# EAGLE design ppmacBoard (EAGLE 6.4)
DATABASE: /home/rw247/eagle/db/digikeydb.txt
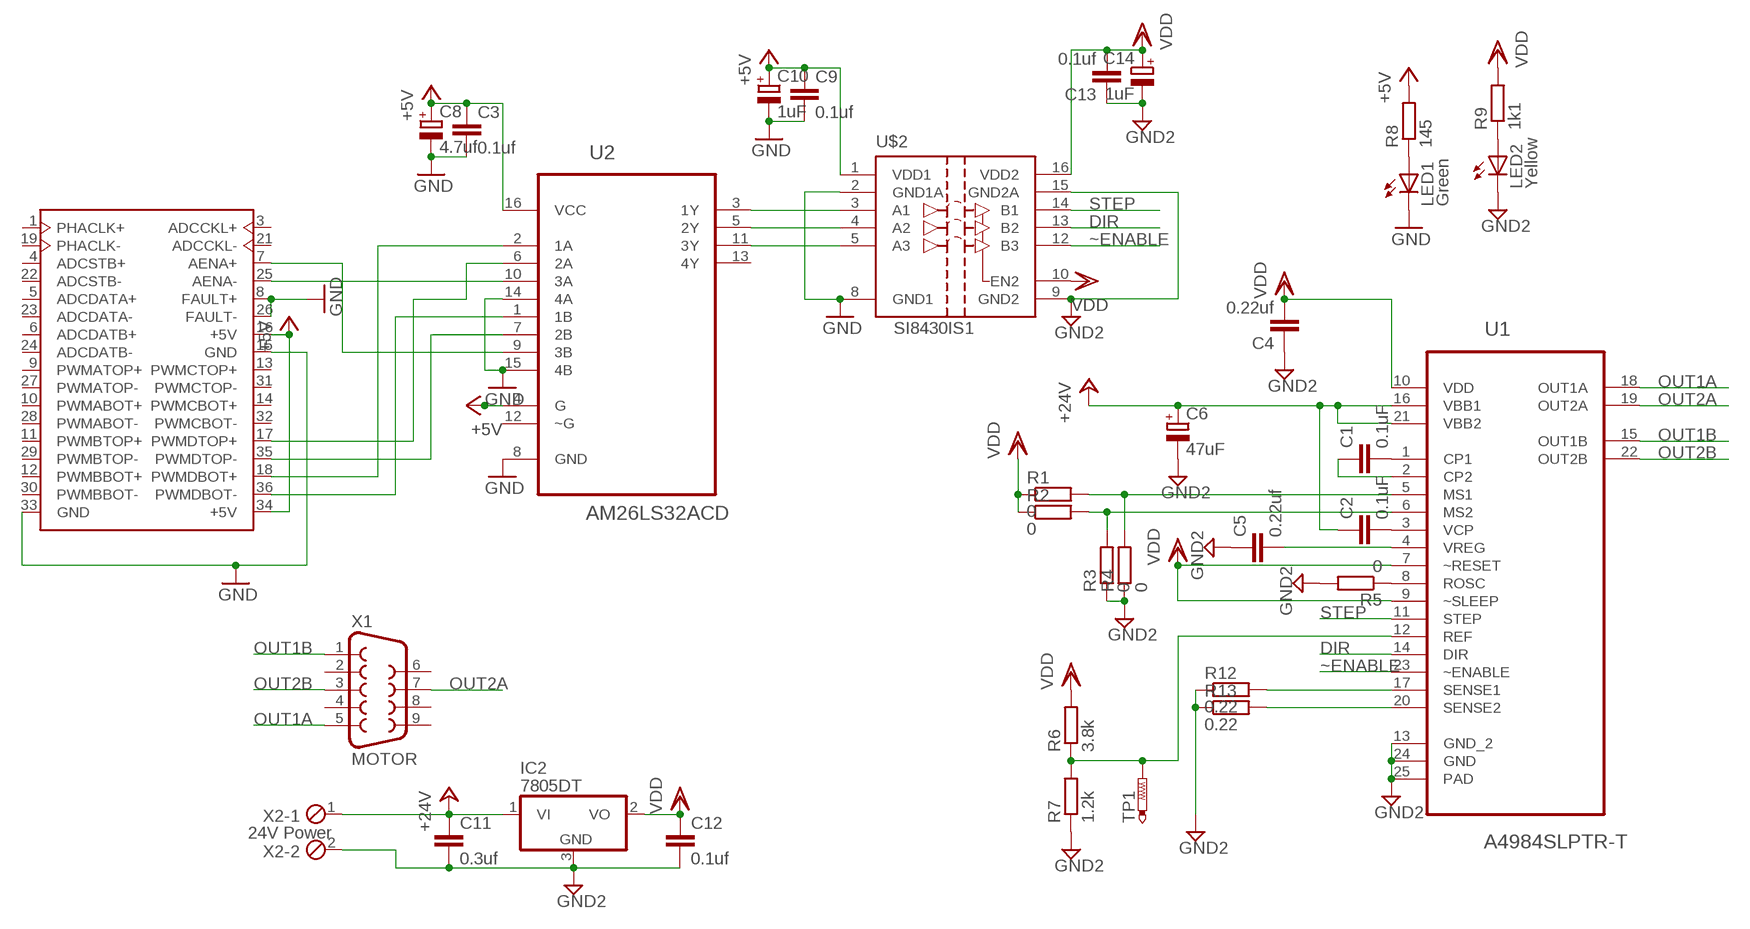
[diagram p0: schematic, sheet 1]

## Parts
C1  0.1uF  C-EUC1206  [C1206]
C2  0.1uF  C-EUC1206  [C1206]
C3  0.1uf  C-EUC1206  [C1206]
C4  0.22uf  C-EUC1206  [C1206]
C5  0.22uf  C-EUC1206  [C1206]
C6  47uF  CPOL-EUE7.5-18  [E7,5-18]
C8  4.7uf  CPOL-EUA/3216-18W  [A/3216-18W]
C9  0.1uf  C-EUC1206  [C1206]
C10  1uF  CPOL-EUA/3216-18W  [A/3216-18W]
C11  0.3uf  C-EUC1206  [C1206]
C12  0.1uf  C-EUC1206  [C1206]
C13  0.1uf  C-EUC1206  [C1206]
C14  1uF  CPOL-EUA/3216-18W  [A/3216-18W]
IC2  7805DT  [TO252]
LED1  Green  LEDSMT1206  [1206]
LED2  Yellow  LEDSMT1206  [1206]
R1  0  R-EU_R1206  [R1206]
R2  0  R-EU_R1206  [R1206]
R3  0  R-EU_R1206  [R1206]
R4  0  R-EU_R1206  [R1206]
R5  0  R-EU_R1206  [R1206]
R6  3.8k  R-EU_R1206  [R1206]
R7  1.2k  R-EU_R1206  [R1206]
R8  145  R-EU_R1206  [R1206]
R9  1k1  R-EU_R1206  [R1206]
R12  0.22  R-EU_R2010  [R2010]
R13  0.22  R-EU_R2010  [R2010]
TP1  PTR1PAD1-13  [P1-13]
U1  A4984SLPTR-T  [SOP65P640X120-24N]
U2  AM26LS32ACD  [SOIC127P600X175-16N]
U$1  DIGAMPOUT_PCB  [3M_10136-52B2PC_PCB]
U$2  SI8430IS1  [SO16]
X1  MOTOR  F09H  [F09H]
X2  24V Power  MPT2  [2POL254]

## Nets
+5V: C3.1 C8.+ C9.1 C10.+ R8.2 U2.4(G) U2.16(VCC) U$1.16(+5V) U$1.34(+5V) U$2.1(VDD1)
+24V: C2.1 C6.+ C11.1 IC2.1(VI) U1.16(VBB1) U1.21(VBB2) X2.1
DIR: U1.14(DIR) U$2.13(B2)
GND: C3.2 C8.- C9.2 C10.- LED1.C U2.8(GND) U2.14(4A) U2.15(4B) U$1.8(FAULT+) U$1.15(GND) U$1.26(FAULT-) U$1.33(GND) U$2.2(GND1A) U$2.8(GND1)
GND2: C4.1 C5.1 C6.- C11.2 C12.2 C13.1 C14.- IC2.3(GND) LED2.C R3.1 R4.1 R5.2 R7.1 R12.1 R13.1 U1.13(GND_2) U1.24(GND) U1.25(PAD) U$2.9(GND2) U$2.15(GND2A) X2.2
N$1: R2.2 R3.2 U1.6(MS2)
N$2: R1.2 R4.2 U1.5(MS1)
N$3: C1.2 U1.1(CP1)
N$4: C2.2 U1.3(VCP)
N$5: C1.1 U1.2(CP2)
N$6: LED1.A R8.1
N$7: R12.2 U1.17(SENSE1)
N$8: R6.1 R7.2 TP1.TP U1.12(REF)
N$9: C5.2 U1.4(VREG)
N$10: R5.1 U1.8(ROSC)
N$12: U2.10(3A) U$1.25(AENA-)
N$13: U2.9(3B) U$1.7(AENA+)
N$14: U2.2(1A) U$1.18(PWMDBOT+)
N$15: U2.1(1B) U$1.36(PWMDBOT-)
N$16: U2.7(2B) U$1.35(PWMDTOP-)
N$17: U2.6(2A) U$1.17(PWMDTOP+)
N$22: U2.3(1Y) U$2.3(A1)
N$23: U2.5(2Y) U$2.4(A2)
N$24: U2.11(3Y) U$2.5(A3)
N$25: LED2.A R9.1
N$30: R13.2 U1.20(SENSE2)
OUT1A: U1.18(OUT1A) X1.5
OUT1B: U1.15(OUT1B) X1.1
OUT2A: U1.19(OUT2A) X1.7
OUT2B: U1.22(OUT2B) X1.3
STEP: U1.11(STEP) U$2.14(B1)
VDD: C4.2 C12.1 C13.2 C14.+ IC2.2(VO) R1.1 R2.1 R6.2 R9.2 U1.7(~RESET) U1.9(~SLEEP) U1.10(VDD) U$2.10(EN2) U$2.16(VDD2)
~ENABLE: U1.23(~ENABLE) U$2.12(B3)
Unconnected: U2.12(~G) U2.13(4Y) U$1.1(PHACLK+) U$1.3(ADCCKL+) U$1.4(ADCSTB+) U$1.5(ADCDATA+) U$1.6(ADCDATB+) U$1.9(PWMATOP+) U$1.10(PWMABOT+) U$1.11(PWMBTOP+) U$1.12(PWMBBOT+) U$1.13(PWMCTOP+) U$1.14(PWMCBOT+) U$1.19(PHACLK-) U$1.21(ADCCKL-) U$1.22(ADCSTB-) U$1.23(ADCDATA-) U$1.24(ADCDATB-) U$1.27(PWMATOP-) U$1.28(PWMABOT-) U$1.29(PWMBTOP-) U$1.30(PWMBBOT-) U$1.31(PWMCTOP-) U$1.32(PWMCBOT-) X1.2 X1.4 X1.6 X1.8 X1.9

## Library data of the parts
C1 C2 = resistor:C-EU: CAPACITOR, European symbol; MPN: MC1206B104K250CT; OC_NEWARK: 06R4206; PARTNO: C1206C104K3RACTU
C3 C9 C12 C13 = resistor:C-EU: CAPACITOR, European symbol; OC_NEWARK: unknown; PARTNO: C1206C104K3RACTU
C4 C5 = resistor:C-EU: CAPACITOR, European symbol; OC_NEWARK: unknown; PARTNO: C1206C224K5RACTU
C6 = resistor:CPOL-EU: POLARIZED CAPACITOR, European symbol; OC_NEWARK: unknown; PARTNO: ESH476M035AE3AA
C8 = resistor:CPOL-EU: POLARIZED CAPACITOR, European symbol; OC_NEWARK: unknown; PARTNO: T491A475M025AT
C10 C14 = resistor:CPOL-EU: POLARIZED CAPACITOR, European symbol; OC_NEWARK: unknown; PARTNO: T491A105K025AT
C11 = resistor:C-EU: CAPACITOR, European symbol; OC_NEWARK: unknown; PARTNO: C3216X7R1E334K
IC2 = linear:78*: Positive VOLTAGE REGULATOR Source: http://cache.national.com/ds/LM/LM78L05.pdf http://www.fairchildsemi.com/ds/LM/LM7805.pdf; OC_NEWARK: unknown; PARTNO: BA17805FP-E2
LED1 = led:LED: LED OSRAM: - CHIPLED LG R971, LG N971, LY N971, LG Q971, LY Q971, LO R971, LY R971 LH N974, LH R974 LS Q976, LO Q976, LY Q976 LO Q996 - Hyper CHIPLED LW Q18S LB Q993, LB Q99A, LB R99A - SideLED LS A670, LO A670, LY A670, LG A670, LP A670 LB A673, LV A673, LT A673, LW A673 LH A674 LY A675 LS A676, LA A676, LO A676, LY A676, LW A676 LS A679, LY A679, LG A679 - Hyper Micro SIDELED® LS Y876, LA Y876, LO Y876, LY Y876 LT Y87S - SmartLED LW L88C, LW L88S LB L89C, LB L89S, LG L890 LS L89K, LO L89K, LY L89K LS L896, LA L896, LO L896, LY L896 - TOPLED LS T670, LO T670, LY T670, LG T670, LP T670 LSG T670, LSP T670, LSY T670, LOP T670, LYG T670 LG T671, LOG T671, LSG T671 LB T673, LV T673, LT T673, LW T673 LH T674 LS T676, LA T676, LO T676, LY T676, LB T676, LH T676, LSB T676, LW T676 LB T67C, LV T67C, LT T67C, LS T67K, LO T67K, LY T67K, LW E67C LS E67B, LA E67B, LO E67B, LY E67B, LB E67C, LV E67C, LT E67C LW T67C LS T679, LY T679, LG T679 LS T770, LO T770, LY T770, LG T770, LP T770 LB T773, LV T773, LT T773, LW T773 LH T774 LS E675, LA E675, LY E675, LS T675 LS T776, LA T776, LO T776, LY T776, LB T776 LHGB T686 LT T68C, LB T68C - Hyper Mini TOPLED® LB M676 - Mini TOPLED Santana® LG M470 LS M47K, LO M47K, LY M47K Source: http://www.osram.convergy.de LUXEON: - LUMILED® LXK2-PW12-R00, LXK2-PW12-S00, LXK2-PW14-U00, LXK2-PW14-V00 LXK2-PM12-R00, LXK2-PM12-S00, LXK2-PM14-U00 LXK2-PE12-Q00, LXK2-PE12-R00, LXK2-PE12-S00, LXK2-PE14-T00, LXK2-PE14-U00 LXK2-PB12-K00, LXK2-PB12-L00, LXK2-PB12-M00, LXK2-PB14-N00, LXK2-PB14-P00, LXK2-PB14-Q00 LXK2-PR12-L00, LXK2-PR12-M00, LXK2-PR14-Q00, LXK2-PR14-R00 LXK2-PD12-Q00, LXK2-PD12-R00, LXK2-PD12-S00 LXK2-PH12-R00, LXK2-PH12-S00 LXK2-PL12-P00, LXK2-PL12-Q00, LXK2-PL12-R00 Source: www.luxeon.com KINGBRIGHT: KA-3528ASYC Source: www.kingbright.com; MPN: KP-3216CGCK; OC_NEWARK: 66W1932; PARTNO: LG N971-KN-1
LED2 = led:LED: LED OSRAM: - CHIPLED LG R971, LG N971, LY N971, LG Q971, LY Q971, LO R971, LY R971 LH N974, LH R974 LS Q976, LO Q976, LY Q976 LO Q996 - Hyper CHIPLED LW Q18S LB Q993, LB Q99A, LB R99A - SideLED LS A670, LO A670, LY A670, LG A670, LP A670 LB A673, LV A673, LT A673, LW A673 LH A674 LY A675 LS A676, LA A676, LO A676, LY A676, LW A676 LS A679, LY A679, LG A679 - Hyper Micro SIDELED® LS Y876, LA Y876, LO Y876, LY Y876 LT Y87S - SmartLED LW L88C, LW L88S LB L89C, LB L89S, LG L890 LS L89K, LO L89K, LY L89K LS L896, LA L896, LO L896, LY L896 - TOPLED LS T670, LO T670, LY T670, LG T670, LP T670 LSG T670, LSP T670, LSY T670, LOP T670, LYG T670 LG T671, LOG T671, LSG T671 LB T673, LV T673, LT T673, LW T673 LH T674 LS T676, LA T676, LO T676, LY T676, LB T676, LH T676, LSB T676, LW T676 LB T67C, LV T67C, LT T67C, LS T67K, LO T67K, LY T67K, LW E67C LS E67B, LA E67B, LO E67B, LY E67B, LB E67C, LV E67C, LT E67C LW T67C LS T679, LY T679, LG T679 LS T770, LO T770, LY T770, LG T770, LP T770 LB T773, LV T773, LT T773, LW T773 LH T774 LS E675, LA E675, LY E675, LS T675 LS T776, LA T776, LO T776, LY T776, LB T776 LHGB T686 LT T68C, LB T68C - Hyper Mini TOPLED® LB M676 - Mini TOPLED Santana® LG M470 LS M47K, LO M47K, LY M47K Source: http://www.osram.convergy.de LUXEON: - LUMILED® LXK2-PW12-R00, LXK2-PW12-S00, LXK2-PW14-U00, LXK2-PW14-V00 LXK2-PM12-R00, LXK2-PM12-S00, LXK2-PM14-U00 LXK2-PE12-Q00, LXK2-PE12-R00, LXK2-PE12-S00, LXK2-PE14-T00, LXK2-PE14-U00 LXK2-PB12-K00, LXK2-PB12-L00, LXK2-PB12-M00, LXK2-PB14-N00, LXK2-PB14-P00, LXK2-PB14-Q00 LXK2-PR12-L00, LXK2-PR12-M00, LXK2-PR14-Q00, LXK2-PR14-R00 LXK2-PD12-Q00, LXK2-PD12-R00, LXK2-PD12-S00 LXK2-PH12-R00, LXK2-PH12-S00 LXK2-PL12-P00, LXK2-PL12-Q00, LXK2-PL12-R00 Source: www.luxeon.com KINGBRIGHT: KA-3528ASYC Source: www.kingbright.com; MPN: KP-3216SYCK; OC_NEWARK: 66W1938; PARTNO: APT3216YC
R1-R5 = resistor:R-EU_: RESISTOR, European symbol; OC_NEWARK: unknown; PARTNO: RMCF1206ZT0R00
R6 = resistor:R-EU_: RESISTOR, European symbol; OC_NEWARK: unknown; PARTNO: RMCF1206FT3K83
R7 = resistor:R-EU_: RESISTOR, European symbol; OC_NEWARK: unknown; PARTNO: RC1206FR-071K2L
R8 = resistor:R-EU_: RESISTOR, European symbol; OC_NEWARK: unknown; PARTNO: RC1206FR-07140RL
R9 = resistor:R-EU_: RESISTOR, European symbol; OC_NEWARK: unknown; PARTNO: RC1206FR-071K1L
R12 R13 = resistor:R-EU_: RESISTOR, European symbol; OC_NEWARK: unknown; PARTNO: WSLT2010R2200FEB18
TP1 = testpad:PTR1: TEST PIN; OC_NEWARK: unknown
U1 = Allegro_By_element14_Batch_1:A4984SLPTR-T: DMOS Microstepping Driver with Translator and Overcurrent Protection; MPN: A4984SLPTR-T; OC_FARNELL: -; OC_NEWARK: 67R9671; PACKAGE: TSSOP-24; PARTNO: A4984SLPTR-T; SUPPLIER: Allegro
U2 = Texas Instruments_By_element14_Batch_1:AM26LS32ACD: QUADRUPLE RS-485 DIFFERENTIAL LINE RECEIVERS; MF: TEXAS INSTRUMENTS; MPN: AM26LS32ACD; OC_FARNELL: 1103045; OC_NEWARK: 06F1118; PACKAGE: SOIC-16; PARTNO: AM26LS32ACDR; SUPPLIER: TEXAS INSTRUMENTS
U$1 = ppmac:DIGAMPOUT_PCB: This is the PCB side to connect to the power PMAC digital amplifier board; OC_NEWARK: unknown; PARTNO: 10136-3000PE
U$2 = silicon-labs:SI8430: Si8430 3 Channel (3/0) Digital Isolator Silicon Labs Si84xx ISOpro digital isolator series. The Si84xx ISOpro digital isolators provide low power galvanic isolation for digital signals. The '30 part has all three signals in the same direction, with an output enable. They come in speeds of 1Mbps and 150Mbps, and isolation ratings of 1KV, 2.5KV and 5KV. The independent sides use 2.7-5.5V supplies and draw under 5mA per channel. http://www.silabs.com/Support%20Documents/TechnicalDocs/Si823x.pdf Donald Becker; OC_NEWARK: unknown; PARTNO: SI8430AB-D-IS1
X1 = con-subd:F09: SUB-D; OC_FARNELL: unknown; OC_NEWARK: unknown; PARTNO: DLS1XS5AK40X
X2 = con-phoenix-254:MPT2: PHOENIX CONNECTOR; OC_FARNELL: unknown; OC_NEWARK: unknown; PARTNO: OSTTE020104

## Board
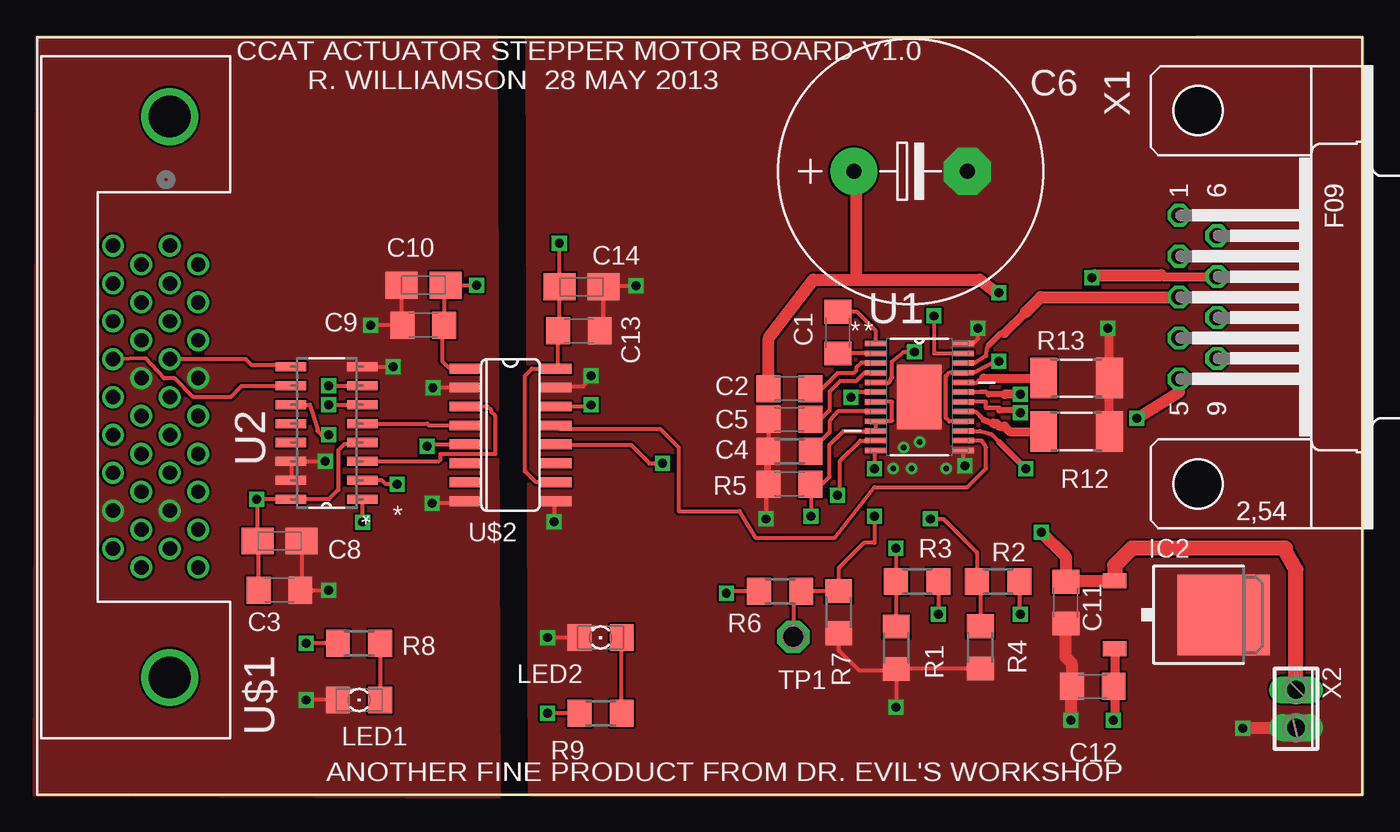
[diagram p1: board, top side]
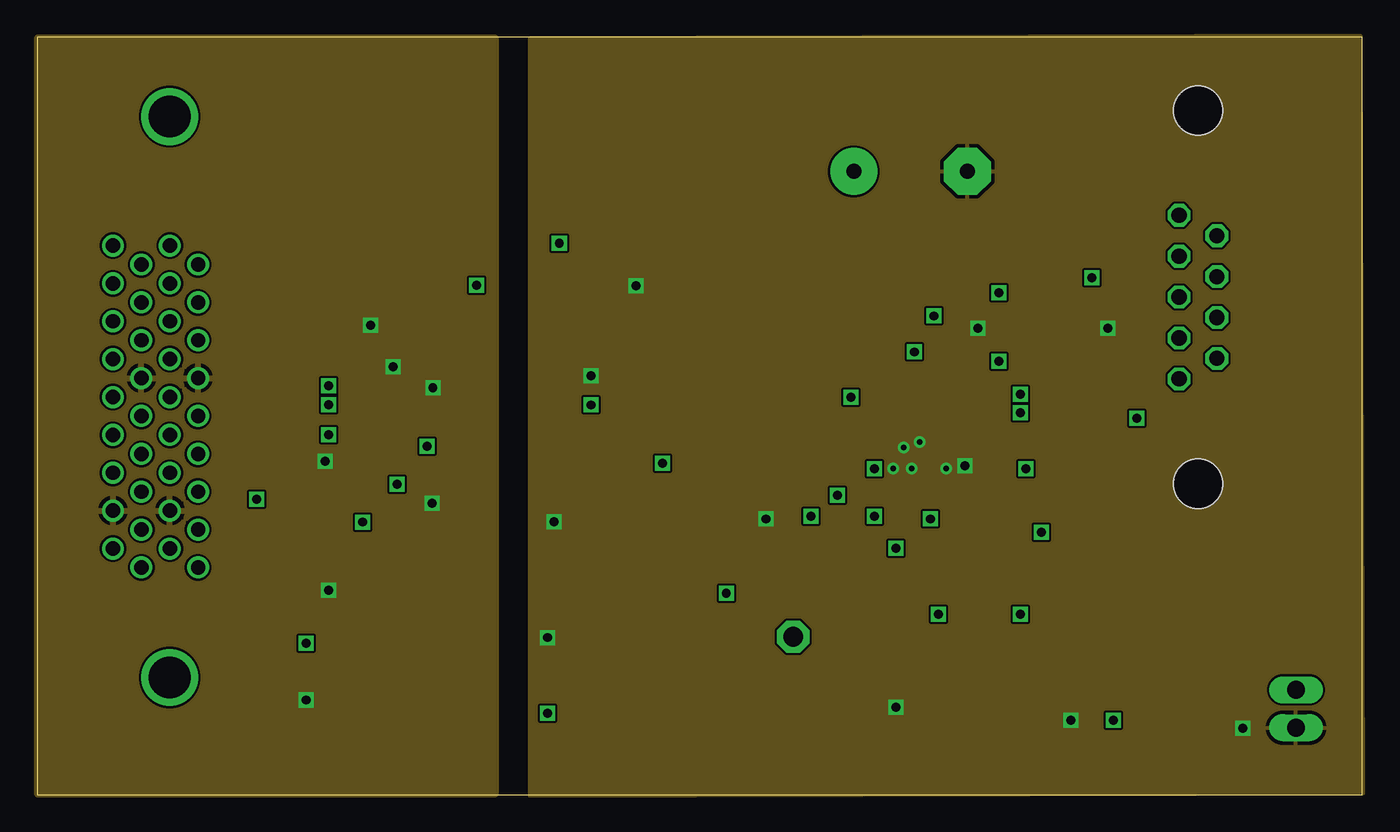
[diagram p2: board, inner layer GND]
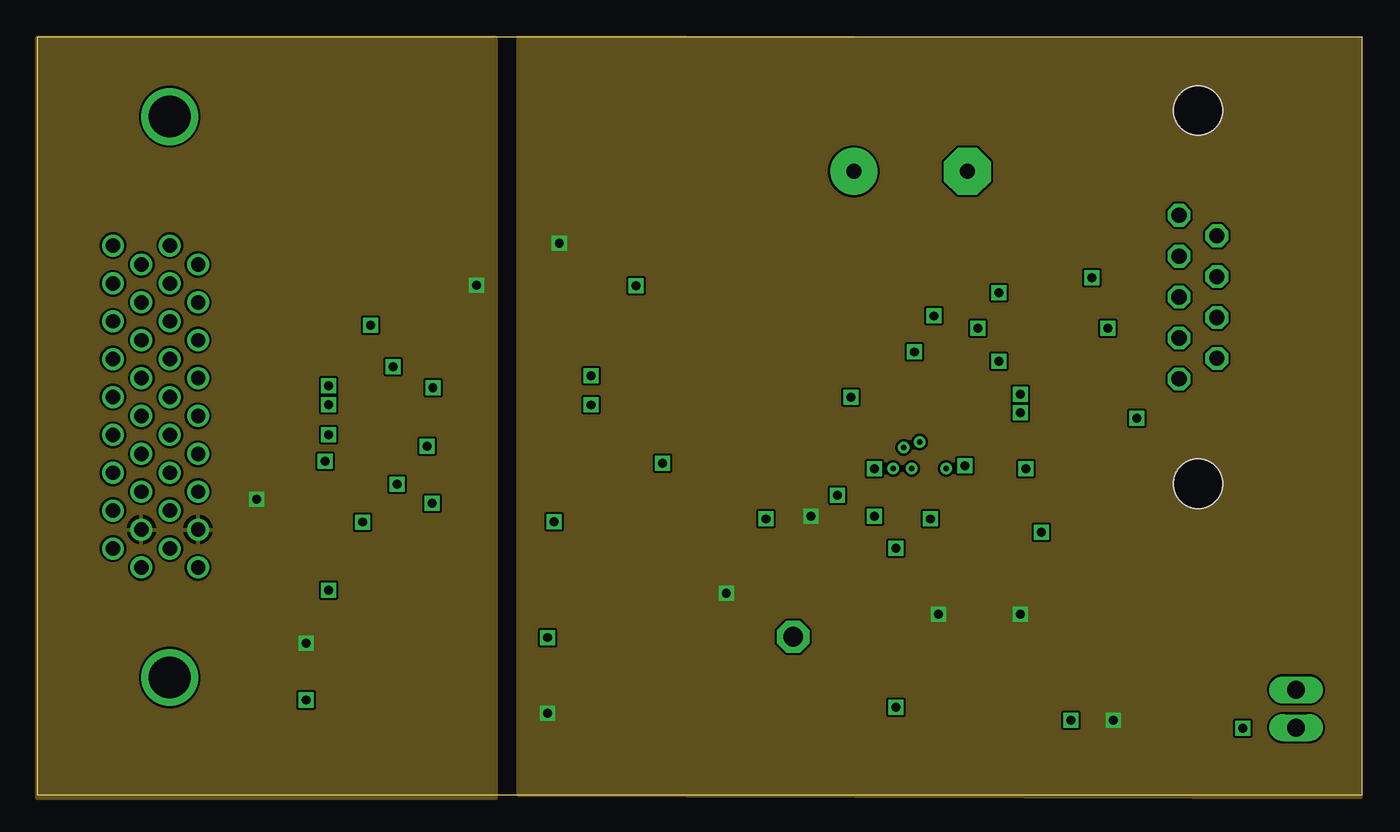
[diagram p3: board, inner layer VCC]
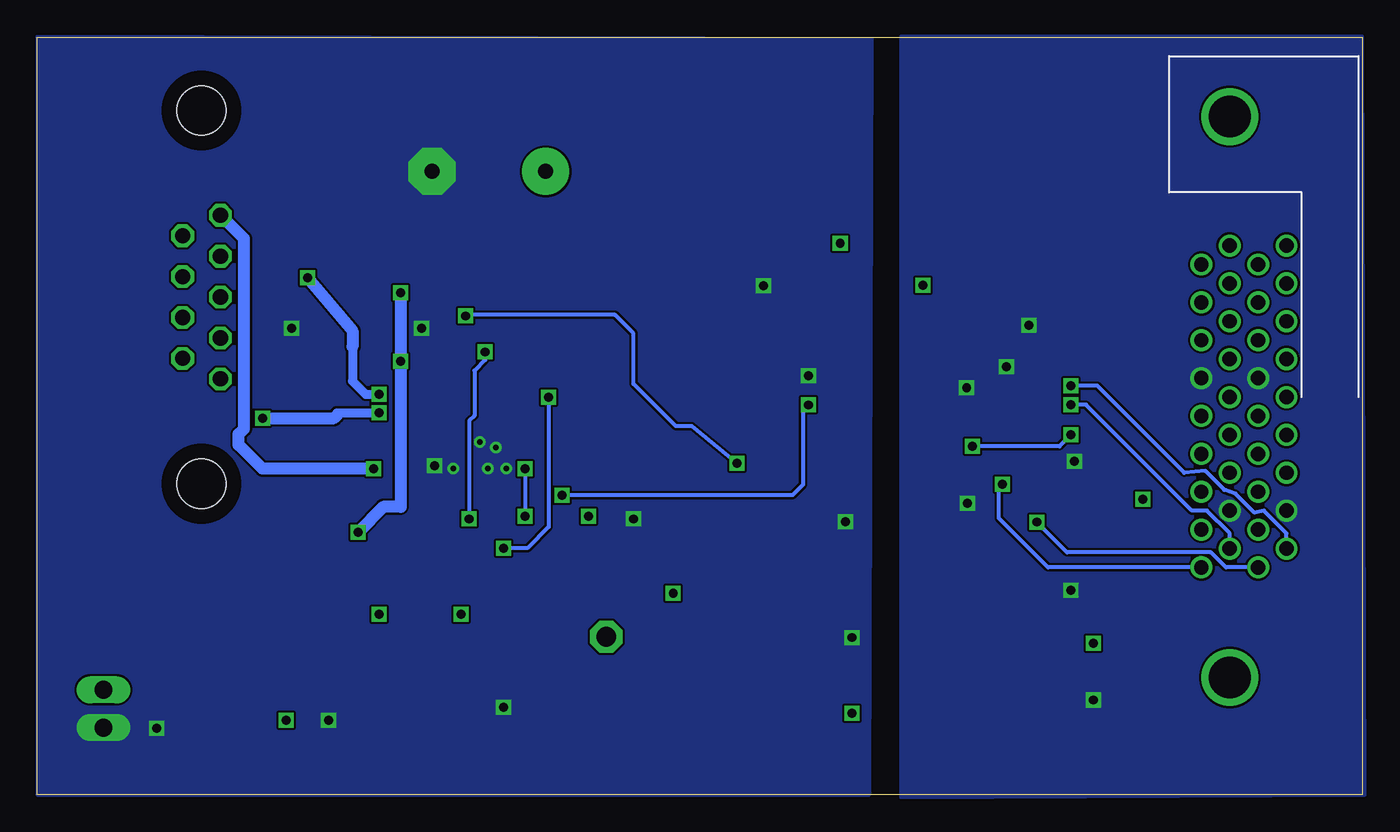
[diagram p4: board, bottom side, seen from below]

Size 88.9 x 50.8 mm. Coordinates in mm from the lower left corner, seen from the top.
Outline: 0,0 88.9,0 88.9,50.8 0,50.8 0,0
Copper layers (1*2+15*16): Top 0.0356mm / dielectric 63mil / GND 0.035mm / dielectric 0.15mm / VCC 0.035mm / dielectric 0.2mm / Bottom 0.0356mm
Design rules "advanced *": minimum track width 6mil, minimum drill 15mil, track to track 6mil, track to pad 6mil, pad to pad 6mil, via to via 6mil, smd to smd 6mil, copper to edge 0mil, drill to drill 6mil, minimum pad ring 10mil, minimum via ring 8mil, stop-mask expansion 4mil, vias tented up to drill 0mil, thermal gap 10mil

### Footprints (pad centres in the part's own frame; a part is rotated, then mirrored left to right if it is on the bottom)
C1206 = smd 1.6 x 1.8: 1 -1.4,0; 2 1.4,0
E7,5-18 = drill 1.016 pad 3.15: + -3.81,0 | drill 1.016 pad 3.15 octagon: - 3.81,0
A/3216-18W = smd 2.15 x 1.8: + 1.475,0; - -1.475,0
TO252 = smd 1 x 1.6: 1 -2.28,-4.8; 2 2.28,-4.8 | smd 5.4 x 6.2: 3 0,2.5
1206 = smd 1.6 x 1.803: A -1.422,0; C 1.422,0
R1206 = smd 1.6 x 1.803: 1 -1.422,0; 2 1.422,0
R2010 = smd 1.8 x 2.7: 1 -2.2,0; 2 2.2,0
P1-13 = drill 1.321 pad 2.159 octagon: TP 0,0
SOP65P640X120-24N = smd 1.473 x 0.356: 1 -2.921,3.581; 2 -2.921,2.921; 3 -2.921,2.286; 4 -2.921,1.626; 5 -2.921,0.965; 6 -2.921,0.33; 7 -2.921,-0.33; 8 -2.921,-0.965; 9 -2.921,-1.626; 10 -2.921,-2.286; 11 -2.921,-2.921; 12 -2.921,-3.581; 13 2.921,-3.581; 14 2.921,-2.921; 15 2.921,-2.286; 16 2.921,-1.626; 17 2.921,-0.965; 18 2.921,-0.33; 19 2.921,0.33; 20 2.921,0.965; 21 2.921,1.626; 22 2.921,2.286; 23 2.921,2.921; 24 2.921,3.581 | smd 2.997 x 4.318: 25 0,0
SOIC127P600X175-16N = smd 2.057 x 0.61: 1 -4.801,8.89; 2 -4.801,7.62; 3 -4.801,6.35; 4 -4.801,5.08; 5 -4.801,3.81; 6 -4.801,2.54; 7 -4.801,1.27; 8 -4.801,0; 9 0,0; 10 0,1.27; 11 0,2.54; 12 0,3.81; 13 0,5.08; 14 0,6.35; 15 0,7.62; 16 0,8.89
3M_10136-52B2PC_PCB = drill 0.965: 1 10.16,0; 2 8.89,-1.905; 3 7.62,0; 4 6.35,-1.905; 5 5.08,0; 6 3.81,-1.905; 7 2.54,0; 8 1.27,-1.905; 9 0,0; 10 -1.27,-1.905; 11 -2.54,0; 12 -3.81,-1.905; 13 -5.08,0; 14 -6.35,-1.905; 15 -7.62,0; 16 -8.89,-1.905; 17 -10.16,0; 18 -11.43,-1.905; 19 10.16,3.81; 20 8.89,1.905; 21 7.62,3.81; 22 6.35,1.905; 23 5.08,3.81; 24 3.81,1.905; 25 2.54,3.81; 26 1.27,1.905; 27 0,3.81; 28 -1.27,1.905; 29 -2.54,3.81; 30 -3.81,1.905; 31 -5.08,3.81; 32 -6.35,1.905; 33 -7.62,3.81; 34 -8.89,1.905; 35 -10.16,3.81; 36 -11.43,1.905 | drill 2.794: 37 -18.809,0; 38 18.809,0
SO16 = smd 0.66 x 2.032: 1 -4.445,-3.073; 2 -3.175,-3.073; 3 -1.905,-3.073; 4 -0.635,-3.073; 5 0.635,-3.073; 6 1.905,-3.073; 7 3.175,-3.073; 8 4.445,-3.073; 9 4.445,3.073; 10 3.175,3.073; 11 1.905,3.073; 12 0.635,3.073; 13 -0.635,3.073; 14 -1.905,3.073; 15 -3.175,3.073; 16 -4.445,3.073
F09H = drill 1.016 octagon: 1 -5.486,-1.27; 2 -2.743,-1.27; 3 0,-1.27; 4 2.743,-1.27; 5 5.486,-1.27; 6 -4.115,1.27; 7 -1.372,1.27; 8 1.372,1.27; 9 4.115,1.27 | hole 3.302: -12.522,0; 12.522,0
2POL254 = drill 1.2 long: 1 -1.27,0; 2 1.27,0

### Placement (x,y rotation side)
C1  53.72,30.99 90 top
C2  50.47,27.23 0 top
C3  16.26,13.72 0 top
C4  50.47,20.83 0 top
C5  50.47,25.17 0 top
C6  58.6,41.81 0 top
C8  16.26,17.02 180 top
C9  25.91,31.5 180 top
C10  25.91,34.16 0 top
C11  69.01,12.88 270 top
C12  70.82,7.26 180 top
C13  36.35,31.11 180 top
C14  36.53,34.06 180 top
IC2  77.09,12.06 270 top
LED1  21.59,6.35 180 top
LED2  37.8,10.54 180 top
R1  64.47,14.3 180 top
R2  59.03,14.3 180 top
R3  57.63,9.86 90 top
R4  63.27,9.88 90 top
R5  50.47,23.04 180 top
R6  49.83,13.64 180 top
R7  53.77,12.24 90 top
R8  21.59,10.16 180 top
R9  37.8,5.46 180 top
R12  69.72,24.36 180 top
R13  69.72,27.94 180 top
TP1  50.72,10.59 0 top
U1  59.18,26.67 0 top
U2  17.02,28.7 180 top
U$1  8.89,26.67 90 top
U$2  31.75,24.13 270 top
X1  77.88,33.38 270 top
X2  84.45,5.77 270 top

### Tracks (layer width: path | path; a pad name or v marks a point on that pad's centre or on a via)
+5V  (via drill 0.6)
  Top 0.254: R8.2 v18.03,10.16 | C3.1 14.86,16.94 C8.+ 14.78,19.76 v14.73,19.81 U2.16 19.56,19.81 20.19,20.45 20.19,23.11 20.57,23.5 21.69,23.5 U2.4 | U$2.1 27.69,28.57 27.18,29.08 27.18,31.37 C9.1 27.31,34.09 C10.+ v29.46,34.16
  pour VCC: 0,50.8 30.73,50.8 30.73,-0.25 0,-0.25
+24V  (via drill 0.6)
  Top 0.254: v64.52,29.08 64.29,29.08 62.87,28.32 62.13,28.32 U1.21 62.08,28.32 61.21,28.32 60.96,28.07 60.96,25.27 61.19,25.04 U1.16
  Top 0.813: C2.1 49.07,30.61 52.07,34.54 54.94,34.54 | 54.94,34.54 63.25,34.54 64.52,33.53 v64.52,33.66 | C6.+ 54.94,41.66 54.94,34.54 | v67.39,17.6 69.01,15.98 C11.1 69.08,14.35 IC2.1
  Top 1.016: X2.1 84.45,15.11 83.74,16.36 83.74,16.54 73.43,16.54 72.29,15.39 IC2.1
  Bottom 0.813: v64.52,33.66 v64.52,29.08 64.52,19.3 65.68,19.3 v67.39,17.6
DIR
  Top 0.254: U$2.13 35.05,24.54 41.78,24.54 43.03,23.29 43.03,19.02 47.12,19.02 48.18,17.25 53.52,17.25 56.19,20.62 62.41,20.62 63.65,21.87 63.65,23.29 63.37,23.75 U1.14
GND  (via drill 0.6)
  Top 0.254: LED1.C v18.03,6.35 | C8.- 17.73,13.79 C3.2 v19.56,13.72 | U2.8 v23.88,28.7 | v19.3,22.35 U2.14 U2.15 | C10.- 24.43,31.7 24.51,31.62 C9.2 v22.35,31.5 | U$2.2 v26.54,27.3 | U$2.8 28.55,19.56 v26.49,19.56
  pour GND: 0,50.8 30.73,50.8 30.73,24.64 30.73,0 0,0
  pour Top (no thermals): 0,50.85 30.76,50.85 30.94,-0.18 -0.18,0
  pour Bottom (no thermals): 0,50.85 30.94,50.85 30.94,-0.18 -0.18,0
GND2  (via drill 0.38 pad 0.48, 0.6)
  Top 0.254: LED2.C v34.24,10.54 | U$2.9 34.67,19.53 v34.67,18.31 | C5.1 49.05,25.15 R5.2 | R5.2 49.07,23.02 C4.1 | R5.2 48.9,22.89 v48.9,18.49 | C13.1 38,31.37 C14.- 38.08,34.14 v40.18,34.14 | U$2.15 34.9,27.38 36.63,27.38 37.16,27.91 v37.16,28.09 | R4.1 63.25,8.43 R3.1 | R7.1 53.77,9.7 55.12,8.36 57.56,8.36 R3.1 | R3.1 57.63,5.89 v57.61,5.87 | U1.24 62.79,30.25 63.12,30.58 v63.12,31.29 | U1.13 62.1,22.1 62.05,22.05 v62.23,22.05
  Top 0.61: R12.1 R13.1 71.92,31.2 v71.83,31.29
  Top 0.813: C11.2 68.99,11.45 68.99,9.25 69.42,8.82 C12.2 69.34,7.19 v69.34,4.98 | X2.2 84.4,4.45 v80.9,4.45
  other vias: 58.14,23.29 59.21,23.65 60.99,21.87 58.67,21.87 57.43,21.87
  pour GND: 88.8,50.9 33.05,50.72 33.05,-0.08 88.98,0.1
  pour Top (no thermals): 54.05,17.07 64.54,17.07 64.54,35.92 53.87,35.92 53.7,17.07
  pour Top (no thermals): 32.89,50.67 88.9,50.85 88.9,0 33.07,0
  pour Bottom (no thermals): 32.89,50.67 88.9,50.85 88.9,0 33.07,0
N$1  (via drill 0.6)
  Top 0.254: R3.2 57.61,11.3 R2.2 v57.61,16.54 | U1.6 54.91,27 v54.59,26.67
  Bottom 0.254: v54.59,26.67 54.59,17.96 56.01,16.54 v57.61,16.54
N$2  (via drill 0.6)
  Top 0.254: U1.5 57.15,27.64 57.35,27.99 57.35,29.06 58.14,29.69 v58.85,29.69 | v59.92,18.49 60.81,18.49 63.04,16.26 R1.2 63.27,14.07 R4.2
  Bottom 0.254: v58.85,29.69 58.85,29.16 59.56,28.45 59.56,25.43 59.92,25.07 v59.92,18.49
N$3
  Top 0.254: U1.1 56.26,31.11 54.99,32.39 C1.2
N$4
  Top 0.254: U1.3 56.24,28.98 55.3,28.98 54.94,28.63 54.94,28.45 54.76,28.27 53.7,28.27 52.65,27.23 C2.2
N$5
  Top 0.254: U1.2 C1.1
N$6
  Top 0.254: R8.1 LED1.A
N$7
  Top 0.254: U1.17 62.94,25.7 63.25,25.4
  Top 0.305: 63.25,25.4 63.5,25.15
  Top 0.406: 63.5,25.15 64.14,24.92
  Top 0.61: 64.14,24.92 64.16,24.89 64.36,24.89 64.54,24.71 64.9,24.71 65.25,24.36 R12.2
N$8  (via drill 0.6)
  Top 0.254: U1.12 56.19,23.01 v56.19,21.87 | v56.19,18.67 56.19,16.89 55.47,16.89 53.77,15.19 R7.2 53.75,13.64 R6.1 50.72,13.11 TP1.TP
  Bottom 0.254: v56.19,21.87 v56.19,18.67
N$9
  Top 0.254: U1.4 56.24,28.27 55.47,28.27 54.94,27.74 53.87,27.74 53.16,27.03 53.16,25.78 52.55,25.17 C5.2
N$10
  Top 0.254: U1.8 53.72,25.7 53.16,25.07 53.16,24.31 R5.1
N$12
  Top 0.254: U2.10 16.97,27.38 13.69,27.38 12.98,26.67 10.46,26.67 9.22,27.91 8.51,27.91 7.26,29.26 U$1.25
N$13
  Top 0.254: U2.9 16.92,28.8 14.4,28.8 13.99,29.21 U$1.7
N$14  (via drill 0.6)
  Top 0.254: v24.13,20.83 23.37,20.83 23.11,21.08 U2.2
  Bottom 0.254: U$1.18 21.08,15.24 24.38,18.54 24.38,20.57 v24.13,20.83
N$15  (via drill 0.6)
  Top 0.254: v21.84,18.29 21.84,19.79 U2.1
  Bottom 0.254: U$1.36 9.14,15.24 10.16,16.26 19.81,16.26 v21.84,18.29
N$16  (via drill 0.6)
  Top 0.254: v19.56,27.43 U2.7
  Bottom 0.254: U$1.35 5.08,17.53 6.6,19.05 7.24,18.92 8.51,20.19 9.27,20.45 10.54,21.72 11.94,21.59 17.78,27.43 v19.56,27.43
N$17  (via drill 0.6)
  Top 0.254: v19.56,26.16 U2.6
  Bottom 0.254: U$1.17 8.89,17.53 10.41,19.05 11.43,19.05 18.54,26.16 v19.56,26.16
N$22
  Top 0.254: U2.3 26.92,22.35 27.05,22.48 27.05,22.86 30.73,22.86 30.73,25.4 30.48,25.65 30.48,25.78 30.23,26.04 U$2.3
N$23
  Top 0.254: U2.5 26.16,24.89 26.29,24.77 U$2.4
N$24  (via drill 0.6)
  Top 0.254: U2.11 18.29,26.16 18.8,24.51 18.8,24.38 19.05,24.13 v19.56,24.13 | v26.16,23.37 26.29,23.5 U$2.5
  Bottom 0.254: v19.56,24.13 20.32,23.37 v26.16,23.37
N$25
  Top 0.254: R9.1 LED2.A
N$30
  Top 0.254: U1.20 63.07,27.64 63.12,27.69
  Top 0.305: 63.12,27.69 63.37,27.94 63.5,27.94
  Top 0.61: 63.5,27.94 R13.2
OUT1A  (via drill 0.6)
  Top 0.254: 63.65,25.96 63.65,26.34 U1.18
  Top 0.305: 64.54,25.78 64.54,25.96 63.65,25.96
  Top 0.406: v65.96,25.6 65.96,25.78 64.54,25.78
  Top 0.813: v73.79,25.25 76.61,27 X1.5
  Bottom 0.61: 68.81,25.43 68.81,25.6 v65.96,25.6
  Bottom 0.813: v73.79,25.25 68.99,25.25 68.81,25.43
OUT1B  (via drill 0.6)
  Top 0.254: U1.15 63.27,24.38 63.6,24.31 64.01,24.18 64.54,23.65
  Top 0.406: 64.54,23.65 v66.32,21.87
  Bottom 0.813: v66.32,21.87 73.79,21.87 75.39,23.47 75.39,24.18 75.03,24.54 75.03,37.29 X1.1
OUT2A  (via drill 0.6)
  Top 0.254: 63.3,27.03 63.27,27 U1.19
  Top 0.305: 63.83,26.85 63.65,27.03 63.3,27.03
  Top 0.406: 64.9,26.85 63.83,26.85
  Top 0.61: v65.96,26.85 64.9,26.85 | 75.39,34.85 75.49,34.75 X1.7
  Top 0.813: v70.76,34.67 70.94,34.85 75.39,34.85
  Bottom 0.61: 67.74,30.05 67.74,27.74 66.85,26.85 v65.96,26.85
  Bottom 0.813: v70.76,34.67 67.74,31.11 67.74,30.05
OUT2B
  Top 0.254: U1.22 62.13,28.98 62.92,28.98 63.65,29.44 63.75,30.02 63.93,30.2 63.83,30.12
  Top 0.406: 64.9,30.94 64.64,30.94 63.83,30.12
  Top 0.61: 66.32,32.36 64.9,30.94
  Top 0.813: 66.32,32.36 67.33,33.38 X1.3
STEP  (via drill 0.6)
  Top 0.254: v37.16,26.14 37.06,26.04 U$2.14 | v53.7,20.09 53.87,20.27 53.87,22.4 55.22,23.75 U1.11
  Bottom 0.254: v37.16,26.14 37.52,25.78 37.52,20.8 38.23,20.09 v53.7,20.09
VDD  (via drill 0.6)
  Top 0.254: R9.2 v34.24,5.46 | R2.1 v60.45,12.09 | R6.2 46.35,13.64 v46.23,13.51 | R1.1 65.89,12.17 v65.96,12.09 | U$2.10 33.45,20.95 32.72,21.69 32.72,28.09 33.2,28.57 U$2.16 34.95,28.7 C13.2 35.05,31.22 C14.+ 35.05,36.96 v35.03,36.98 | U1.7 57.35,26.34 57.35,25.09 56.29,25.07 U1.9 U1.10 54.08,24.38 53.16,23.47 53.16,21.34 52.65,20.83 C4.2 51.92,20.78 v51.92,18.67
  Top 0.61: C12.1 72.29,7.34 IC2.2 72.29,5.08 v72.19,4.98
  pour VCC: 88.8,50.62 32.26,50.8 32.26,0 88.8,-0.18
~ENABLE  (via drill 0.6)
  Top 0.254: v60.17,32.11 60.17,29.59 U1.23 | U$2.12 34.85,23.47 39.83,23.47 41.07,22.23 v41.96,22.23
  Bottom 0.254: v41.96,22.23 44.98,24.71 46.05,24.71 48.9,27.56 48.9,30.94 50.14,32.18 59.92,32.18 60.1,32 v60.17,32.11

### Text on the board
_tsilk: CCAT ACTUATOR STEPPER MOTOR BOARD V1.0 | X1 | R. WILLIAMSON 28 MAY 2013 | C6 | 1 | 6 | F09 | C14 | C10 | C9 | C13 | U1 | R13 | C1 | * | C2 | U2 | 5 | 9 | C5 | C4 | R12 | R5 | * | 2,54 | U$2 | R2 | C8 | R3 | IC2 | C11 | R6 | C3 | R8 | R1 | LED2 | X2 | R4 | TP1 | R7 | LED1 | U$1 | R9 | C12 | ANOTHER FINE PRODUCT FROM DR. EVIL'S WORKSHOP
231bmp: /home/rw247/tmp/ccat.bmp